# EAGLE design din-synch-hub (EAGLE 6.6.0)
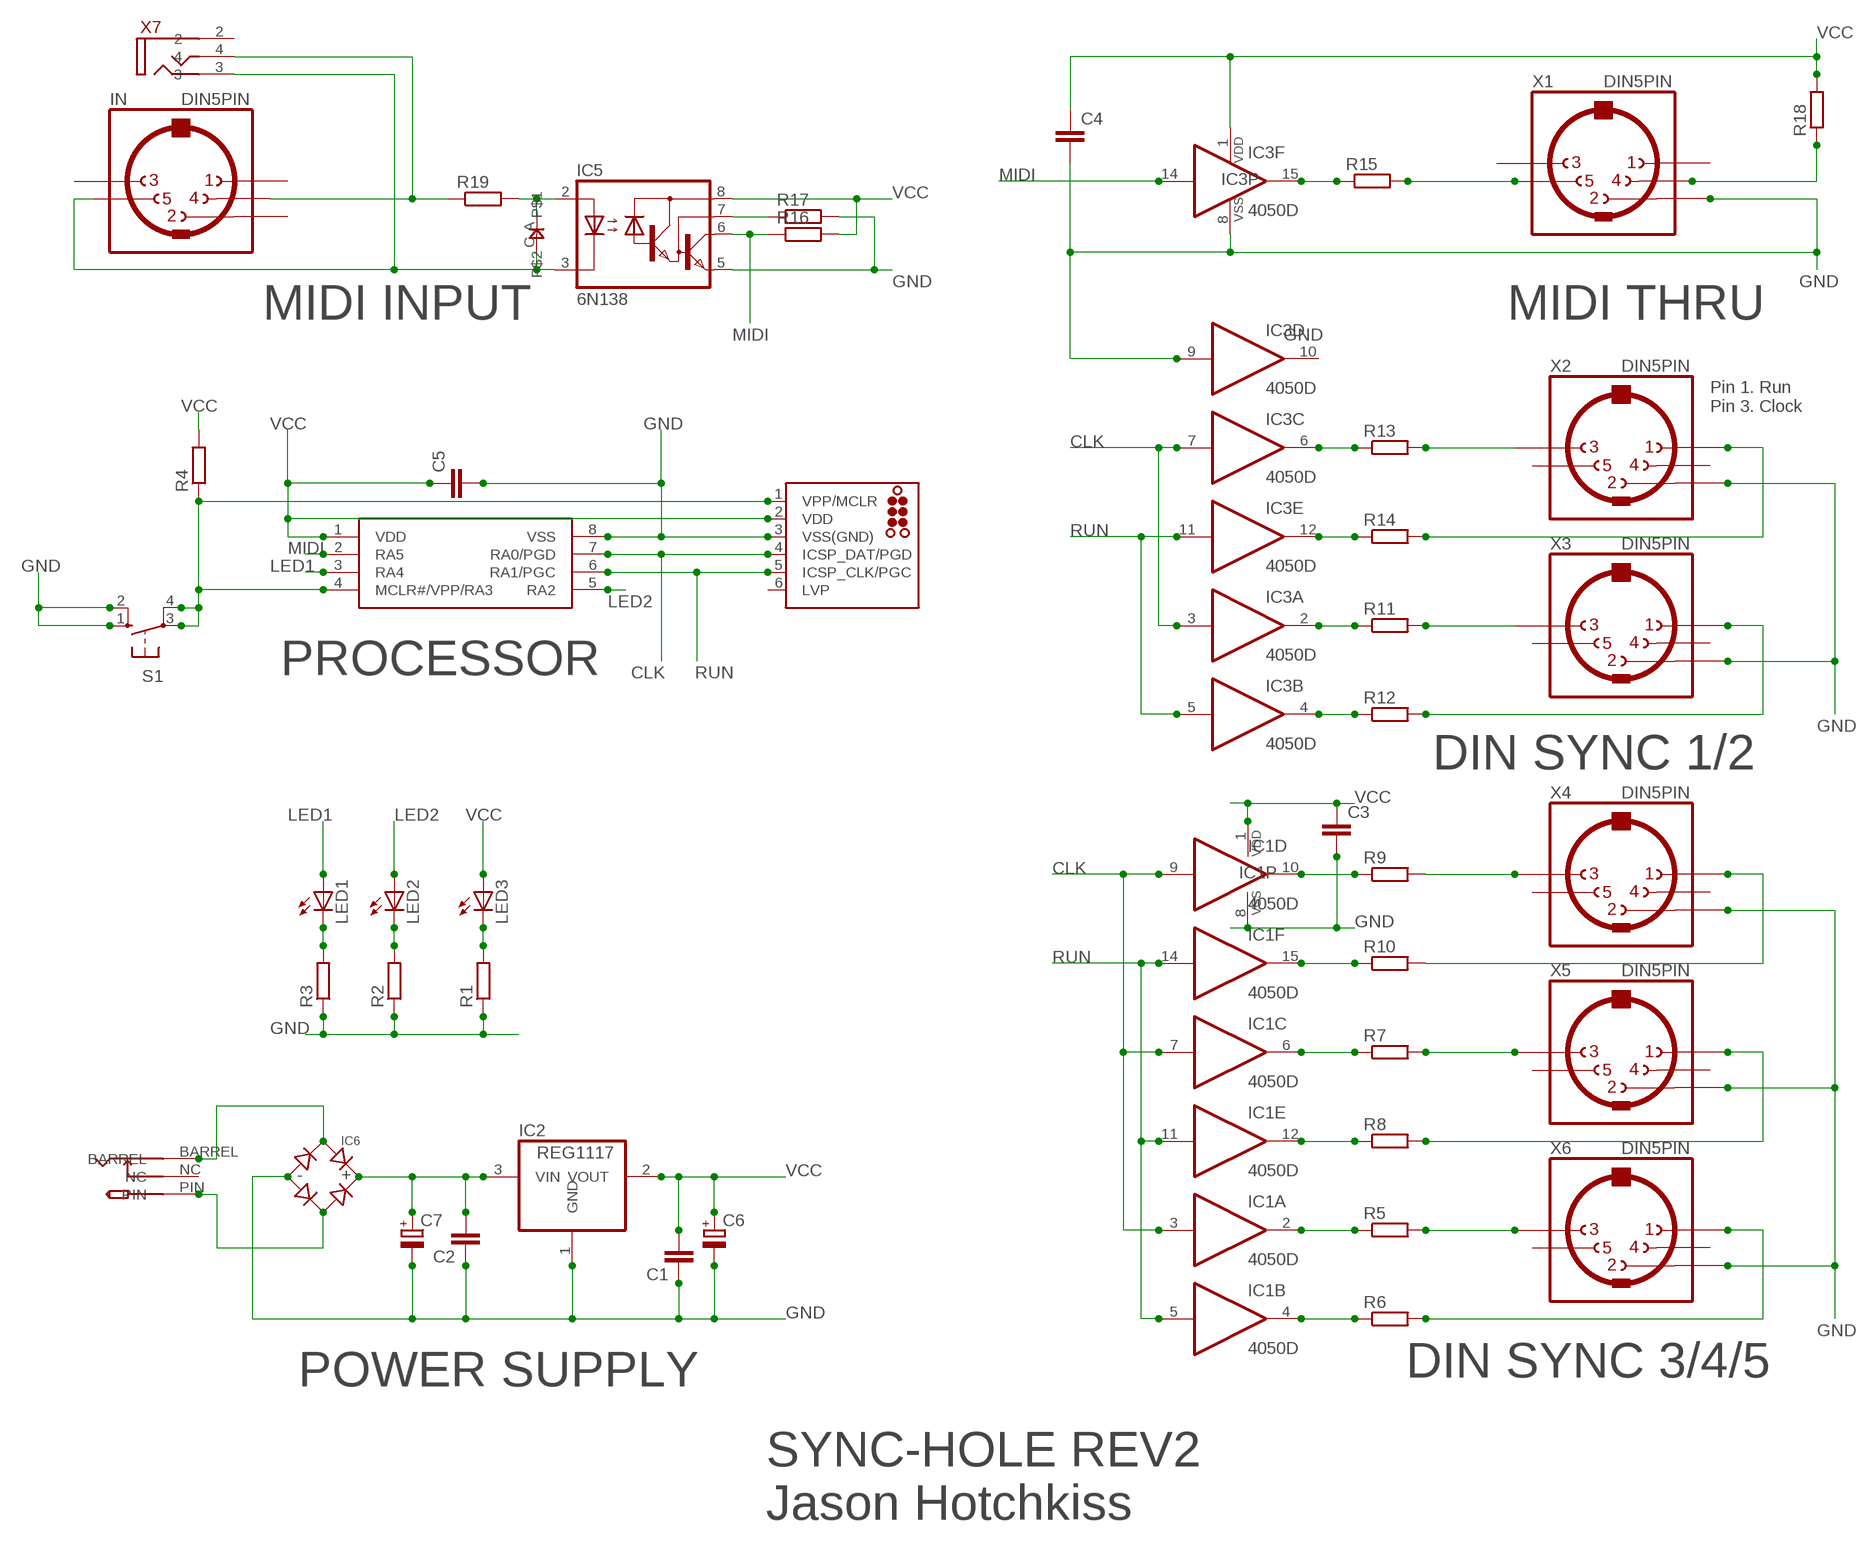
[diagram p0: schematic, sheet 1]

## Parts
C1  C-EUC0805  [C0805]
C2  C-EUC0805  [C0805]
C3  C-EUC0805  [C0805]
C4  C-EUC0805  [C0805]
C5  C-EUC0805  [C0805]
C6  CPOL-EUE2,5-6E  [E2,5-6E]
C7  CPOL-EUE2,5-6E  [E2,5-6E]
D1  0805DIODE  [0805DIODE]
IC1  4050D  [SO16]
IC2  REG1117  [SOT223]
IC3  4050D  [SO16]
IC4  PIC12F1822SO08  [SO08]
IC5  6N138  [DIL08]
IC6  BRIDGERECTIFIER  [SOIC-4]
ICSP  TC2030-MCP-NL  [TC2030-MCP-NL]
IN  DIN5PIN  [EDGEDIN]
LED1  LED3MM  [LED3MM]
LED2  LED3MM  [LED3MM]
LED3  LED3MM  [LED3MM]
R1  R-EU_R0805  [R0805]
R2  R-EU_R0805  [R0805]
R3  R-EU_R0805  [R0805]
R4  R-EU_R0805  [R0805]
R5  R-EU_R0805  [R0805]
R6  R-EU_R0805  [R0805]
R7  R-EU_R0805  [R0805]
R8  R-EU_R0805  [R0805]
R9  R-EU_R0805  [R0805]
R10  R-EU_R0805  [R0805]
R11  R-EU_R0805  [R0805]
R12  R-EU_R0805  [R0805]
R13  R-EU_R0805  [R0805]
R14  R-EU_R0805  [R0805]
R15  R-EU_R0805  [R0805]
R16  R-EU_R0805  [R0805]
R17  R-EU_R0805  [R0805]
R18  R-EU_R0805  [R0805]
R19  R-EU_R0805  [R0805]
S1  10-XX  [B3F-10XX]
U$1  PWR_SOCKET_2_1MM  [PWR_SOCKET_2_1MM]
X1  DIN5PIN  [EDGEDIN]
X2  DIN5PIN  [EDGEDIN]
X3  DIN5PIN  [EDGEDIN]
X4  DIN5PIN  [EDGEDIN]
X5  DIN5PIN  [EDGEDIN]
X6  DIN5PIN  [EDGEDIN]
X7  VERTICAL_3_5MM_SOCKET  [VERTICAL_3_5MM_SOCKET]

## Nets
CLK: IC1.3(A:I) IC1.7(C:I) IC1.9(D:I) IC3.3(A:I) IC3.7(C:I) IC4.7(RA0/PGD) ICSP.4(ICSP_DAT/PGD)
GND: C1.1 C2.1 C3.2 C4.2 C5.2 C6.- C7.- IC1.8(P:VSS) IC2.1(GND) IC3.8(P:VSS) IC3.9(D:I) IC4.8(VSS) IC5.5(GND) IC6.- ICSP.3(VSS(GND)) R1.1 R2.1 R3.1 R17.2 S1.1(S) S1.2(S1) X1.2 X2.2 X3.2 X4.2 X5.2 X6.2
LED1: IC4.3(RA4) LED1.A
LED2: IC4.5(RA2) LED2.A
MIDI: IC3.14(F:I) IC4.2(RA5) IC5.6(VO) R16.1
N$1: IC3.15(F:O) R15.1
N$2: R15.2 X1.5
N$3: IC3.6(C:O) R13.1
N$4: R18.1 X1.4
N$5: IC3.12(E:O) R14.1
N$6: R13.2 X2.3
N$7: IC3.4(B:O) R12.1
N$8: R14.2 X2.1
N$9: IC3.2(A:O) R11.1
N$10: R11.2 X3.3
N$11: R12.2 X3.1
N$12: IC1.15(F:O) R10.1
N$13: IC1.12(E:O) R8.1
N$14: R9.2 X4.3
N$15: IC1.10(D:O) R9.1
N$16: R10.2 X4.1
N$17: IC1.2(A:O) R5.1
N$18: R7.2 X5.3
N$19: IC1.4(B:O) R6.1
N$20: R8.2 X5.1
N$21: IC1.6(C:O) R7.1
N$22: R5.2 X6.3
N$23: R6.2 X6.1
N$25: D1.C IC5.3(C) IN.5 X7.3
N$26: IN.4 R19.1 X7.4
N$27: D1.A IC5.2(A) R19.2
N$28: LED3.K(C) R1.2
N$29: IC5.7(VB) R17.1
N$30: IC4.4(MCLR#/VPP/RA3) ICSP.1(VPP/MCLR) R4.1 S1.3(P) S1.4(P1)
N$31: LED2.K(C) R2.2
N$32: C2.2 C7.+ IC2.3(VIN) IC6.+
N$33: LED1.K(C) R3.2
N$36: IC6.~2(AC2) U$1.PIN
N$37: IC6.~1(AC1) U$1.BARREL
RUN: IC1.5(B:I) IC1.11(E:I) IC1.14(F:I) IC3.5(B:I) IC3.11(E:I) IC4.6(RA1/PGC) ICSP.5(ICSP_CLK/PGC)
VCC: C1.2 C3.1 C4.1 C5.1 C6.+ IC1.1(P:VDD) IC2.2(VOUT) IC3.1(P:VDD) IC4.1(VDD) IC5.8(VCC) ICSP.2(VDD) LED3.A R4.2 R16.2 R18.2
Unconnected: IC3.10(D:O) ICSP.6(LVP) IN.1 IN.2 IN.3 U$1.NC X1.1 X1.3 X2.4 X2.5 X3.4 X3.5 X4.4 X4.5 X5.4 X5.5 X6.4 X6.5 X7.2

## Notes on the sheet
- MIDI INPUT | MIDI THRU
- Pin 1. Run
  Pin 3. Clock
- PROCESSOR
- DIN SYNC 1/2
- POWER SUPPLY | DIN SYNC 3/4/5
- SYNC-HOLE REV2
- Jason Hotchkiss

## Library data of the parts
C1-C5 = rcl:C-EU: CAPACITOR, European symbol
C6 C7 = rcl:CPOL-EU: POLARIZED CAPACITOR, European symbol
D1 = jasons_stuff:0805DIODE
IC1 IC3 = 40xx:4050: Hex non-inverting BUFFER
IC2 = burr-brown:REG1117: 800mA and 1A Low Dropout (LDO) Positive Regulator 1.8V, 2.5V, 2.85V, 3.3V, 5V, and Adj; MPN: REG1117; OC_FARNELL: 1097566; OC_NEWARK: 14P6981
IC4 = jasons_stuff:PIC12F1822
IC5 = optocoupler:6N138: MOTOROLA OPTO COUPLER; MF: VISHAY/TELEFUNKEN; MPN: 6N138; OC_FARNELL: 9860150; OC_NEWARK: 35K5294
IC6 = microbuilder:BRIDGERECTIFIER: Bridge Rectifier SOIC-4: Comchip B4S-G - 400V 800mA, Peak Vf 1.1V (Digikey: 641-1334-1-ND)
ICSP = tag-connect:TC2030: TAG-CONNECT ICSP Connector Manufacturer: Tag-Connect <http://www.tag-connect.com> Cable for easy In-Circuit Serial Programming. Designed for Microchip ICD2, suitable for many others. Two variants - one "with legs" (for hands-free fit on PCB) and another "without legs" for quick programming. PAD Description 1 MCLR/Vpp 2 Vdd 3 GND 4 PGD (ISPDAT) 5 PGC (ISPCLK) 6 nc (used for LVP) ©2009 ROFA.cz - modified and updated by Robert Darlington ‹rdarlington@gmail.com›
IN X1-X6 = jason_eagle6:DIN5PIN: Female CONNECTOR 5 pins 90 deg. with shield, horizontal (DIN 41524)
LED1-LED3 = led:LED: LED OSRAM: - CHIPLED LG R971, LG N971, LY N971, LG Q971, LY Q971, LO R971, LY R971 LH N974, LH R974 LS Q976, LO Q976, LY Q976 LO Q996 - Hyper CHIPLED LW Q18S LB Q993, LB Q99A, LB R99A - SideLED LS A670, LO A670, LY A670, LG A670, LP A670 LB A673, LV A673, LT A673, LW A673 LH A674 LY A675 LS A676, LA A676, LO A676, LY A676, LW A676 LS A679, LY A679, LG A679 - Hyper Micro SIDELED® LS Y876, LA Y876, LO Y876, LY Y876 LT Y87S - SmartLED LW L88C, LW L88S LB L89C, LB L89S, LG L890 LS L89K, LO L89K, LY L89K LS L896, LA L896, LO L896, LY L896 - TOPLED LS T670, LO T670, LY T670, LG T670, LP T670 LSG T670, LSP T670, LSY T670, LOP T670, LYG T670 LG T671, LOG T671, LSG T671 LB T673, LV T673, LT T673, LW T673 LH T674 LS T676, LA T676, LO T676, LY T676, LB T676, LH T676, LSB T676, LW T676 LB T67C, LV T67C, LT T67C, LS T67K, LO T67K, LY T67K, LW E67C LS E67B, LA E67B, LO E67B, LY E67B, LB E67C, LV E67C, LT E67C LW T67C LS T679, LY T679, LG T679 LS T770, LO T770, LY T770, LG T770, LP T770 LB T773, LV T773, LT T773, LW T773 LH T774 LS E675, LA E675, LY E675, LS T675 LS T776, LA T776, LO T776, LY T776, LB T776 LHGB T686 LT T68C, LB T68C - Hyper Mini TOPLED® LB M676 - Mini TOPLED Santana® LG M470 LS M47K, LO M47K, LY M47K Source: http://www.osram.convergy.de LUXEON: - LUMILED® LXK2-PW12-R00, LXK2-PW12-S00, LXK2-PW14-U00, LXK2-PW14-V00 LXK2-PM12-R00, LXK2-PM12-S00, LXK2-PM14-U00 LXK2-PE12-Q00, LXK2-PE12-R00, LXK2-PE12-S00, LXK2-PE14-T00, LXK2-PE14-U00 LXK2-PB12-K00, LXK2-PB12-L00, LXK2-PB12-M00, LXK2-PB14-N00, LXK2-PB14-P00, LXK2-PB14-Q00 LXK2-PR12-L00, LXK2-PR12-M00, LXK2-PR14-Q00, LXK2-PR14-R00 LXK2-PD12-Q00, LXK2-PD12-R00, LXK2-PD12-S00 LXK2-PH12-R00, LXK2-PH12-S00 LXK2-PL12-P00, LXK2-PL12-Q00, LXK2-PL12-R00 Source: www.luxeon.com KINGBRIGHT: KA-3528ASYC Source: www.kingbright.com
R1-R19 = rcl:R-EU_: RESISTOR, European symbol
S1 = switch-omron:10-XX: OMRON SWITCH; MPN: B3F-1000; OC_FARNELL: 176432; OC_NEWARK: 36M3542
U$1 = jason_eagle6:PWR_SOCKET_2_1MM
X7 = jason_eagle6:VERTICAL_3_5MM_SOCKET

## Board
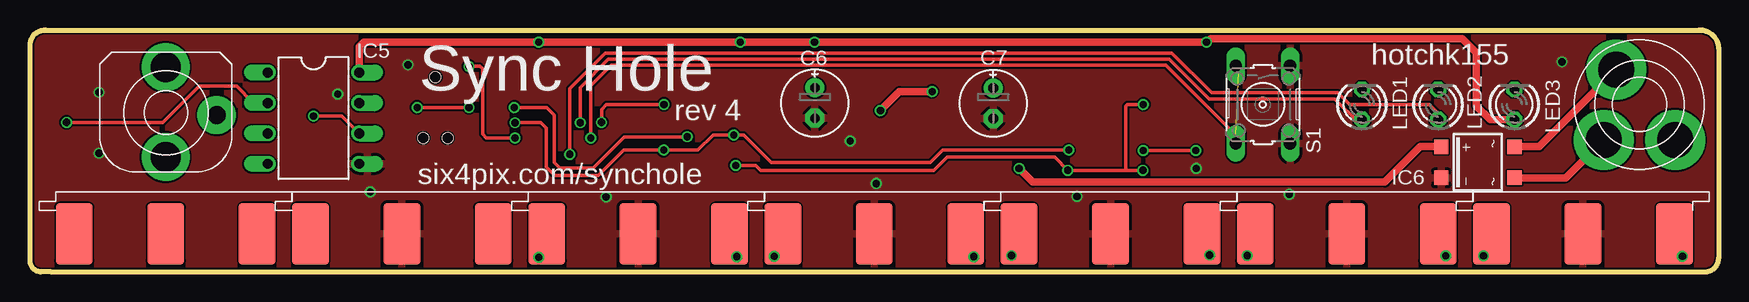
[diagram p1: board, top side]
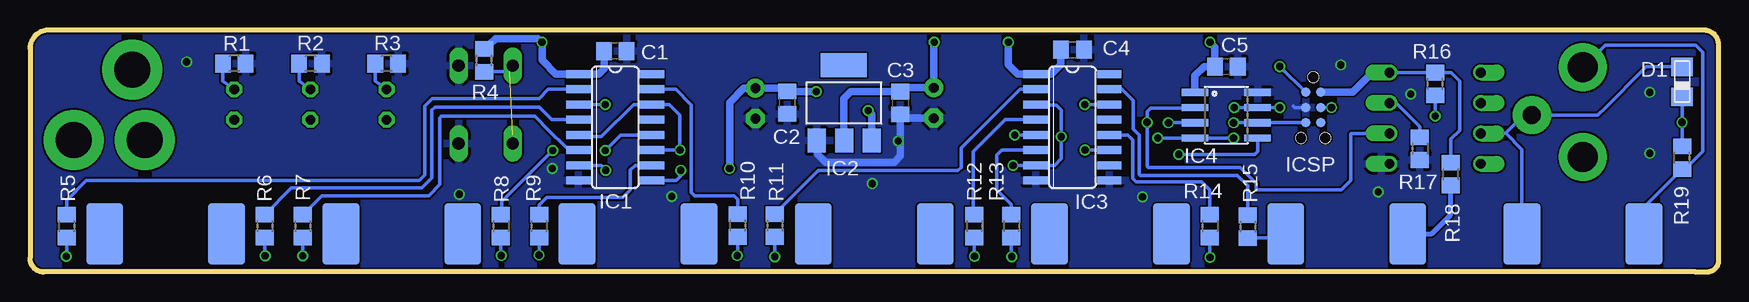
[diagram p2: board, bottom side, seen from below]

Size 140.72 x 20.19 mm. Coordinates in mm from the lower left corner, seen from the top.
Outline: 1.91,0 139.57,0 arc90 140.72,1.14 140.72,18.67 arc90 139.07,20.19 1.27,20.19 arc90 0,18.92 0,1.02 arc90 0.89,0 1.78,0
Copper layers (1*16): Top 0.035mm / dielectric 1.5mm / Bottom 0.035mm
Design rules "hackvana": minimum track width 6mil, minimum drill 0.3mm, track to track 6mil, track to pad 9mil, pad to pad 6mil, via to via 6mil, smd to smd 0mil, copper to edge 6mil, drill to drill 6mil, minimum pad ring 10mil, minimum via ring 6mil, stop-mask expansion 2mil, vias tented up to drill 100mil, thermal gap 10mil

### Footprints (pad centres in the part's own frame; a part is rotated, then mirrored left to right if it is on the bottom)
C0805 = smd 1.3 x 1.5: 1 -0.95,0; 2 0.95,0
E2,5-6E = drill 0.813 pad 1.575: + -1.27,0 | drill 0.813 pad 1.575 octagon: - 1.27,0
0805DIODE = smd 1.524 x 1.778: A -1.262,-0.005; C 1.238,-0.005
SO16 = smd 0.66 x 2.032: 1 -4.445,-3.073; 2 -3.175,-3.073; 3 -1.905,-3.073; 4 -0.635,-3.073; 5 0.635,-3.073; 6 1.905,-3.073; 7 3.175,-3.073; 8 4.445,-3.073; 9 4.445,3.073; 10 3.175,3.073; 11 1.905,3.073; 12 0.635,3.073; 13 -0.635,3.073; 14 -1.905,3.073; 15 -3.175,3.073; 16 -4.445,3.073
SOT223 = smd 1.499 x 2.007: 1 -2.261,-3.15; 2 0.025,-3.15; 3 2.311,-3.15 | smd 3.81 x 2.007: 4 0,3.15
SO08 = smd 0.61 x 2.21: 1 -1.905,-2.616; 2 -0.635,-2.616; 3 0.635,-2.616; 4 1.905,-2.616; 5 1.905,2.616; 6 0.635,2.616; 7 -0.635,2.616; 8 -1.905,2.616
DIL08 = drill 0.813 offset: 1 -3.81,-3.81; 2 -1.27,-3.81; 3 1.27,-3.81; 4 3.81,-3.81; 5 3.81,3.81; 6 1.27,3.81; 7 -1.27,3.81; 8 -3.81,3.81
SOIC-4 = smd 1.2 x 1.2: + 1.3,3.05; - -1.3,3.05; ~1 -1.3,-3.05; ~2 1.3,-3.05
TC2030-MCP-NL = smd 0.787 x 0.787: 1 1.27,-0.635; 2 1.27,0.635; 3 2.54,-0.635; 4 2.54,0.635; 5 3.81,-0.635; 6 3.81,0.635 | hole 0.889: 0,0; 5.08,-1.016; 5.08,1.016
EDGEDIN = smd 3.048 x 5.08: 1 -7.62,-10.16; 2 0,-10.16; 3 7.62,-10.16 | smd 3.048 x 5.08 bottom: 4 -5.08,-10.16; 5 5.08,-10.16
LED3MM = drill 0.813 octagon: A -1.27,0; K 1.27,0
R0805 = smd 1.3 x 1.5: 1 -0.95,0; 2 0.95,0
B3F-10XX = drill 1.016 long: 1 -3.251,2.261; 2 3.251,2.261; 3 -3.251,-2.261; 4 3.251,-2.261
PWR_SOCKET_2_1MM = drill 3 pad 5: BARREL 0,4.2; NC -4.2,0; PIN 3.4,-0.7
VERTICAL_3_5MM_SOCKET = drill 2.5 pad 4: 2 0,-3.75; 4 0,3.75 | drill 1.5 pad 3.2: 3 4.25,-0.25

### Placement (x,y rotation side)
C1  91.95,18.42 180 bottom
C2  77.6,14.13 90 bottom
C3  68.2,14.1 270 bottom
C4  53.85,18.54 0 bottom
C5  41.02,17.14 0 bottom
C6  65.41,14.1 270 top
C7  80.27,14.07 270 top
D1  3.05,15.87 90 bottom
IC1  91.95,12.06 270 bottom
IC2  72.9,14.1 0 bottom
IC3  53.85,12.06 270 bottom
IC4  41.02,13.08 270 bottom
IC5  23.62,12.83 270 top
IC6  120.65,9.14 90 top
ICSP  33.78,16.26 270 bottom
IN  11.3,13.33 0 top
LED1  111,13.97 90 top
LED2  117.35,13.97 90 top
LED3  123.7,13.97 90 top
R1  123.7,17.4 180 bottom
R2  117.35,17.4 180 bottom
R3  111,17.4 180 bottom
R4  102.87,17.65 90 bottom
R5  137.67,3.81 270 bottom
R6  121.16,3.81 270 bottom
R7  117.98,3.81 270 bottom
R8  101.47,3.81 270 bottom
R9  98.3,3.81 270 bottom
R10  81.76,3.87 270 bottom
R11  78.65,3.87 270 bottom
R12  62.01,3.81 270 bottom
R13  58.93,3.81 270 bottom
R14  42.39,3.81 270 bottom
R15  39.24,3.78 270 bottom
R16  23.62,15.68 90 bottom
R17  24.89,10.29 270 bottom
R18  22.32,8.16 90 bottom
R19  3.05,9.52 90 bottom
S1  102.74,13.97 270 top
U$1  134.11,13.97 135 top
X1  30.99,13.33 0 top
X2  50.67,13.33 0 top
X3  70.36,13.33 0 top
X4  90.04,13.33 0 top
X5  109.73,13.33 0 top
X6  129.41,13.33 0 top
X7  11.3,13.33 0 top

### Tracks (layer width: path | path; a pad name or v marks a point on that pad's centre or on a via)
CLK  (via drill 0.6)
  Top 0.305: v36.58,13.72 v32.26,13.72 | v58.8,8.89 60.49,8.89 60.9,8.48 75.31,8.48 76.42,9.59 85.38,9.59 v86.49,8.48 91.31,8.48 | v40.36,13.72 43.05,13.72 43.69,13.08 43.69,9.11 44.13,8.67 46.93,8.67 49.53,11.27 v54.77,11.27 | v92.77,13.97 91.44,13.97 91.31,13.84 91.31,8.48 | v92.74,8.48 91.31,8.48
  Bottom 0.305: v36.58,13.72 IC4.7 v40.36,13.72 | v32.26,13.72 ICSP.4 | v92.77,13.97 IC1.3 | IC1.9 86.87,7.62 86.52,7.97 v86.49,8.48 | IC1.7 93.09,8.89 v92.74,8.48 | v58.8,8.89 IC3.7 55.34,8.89 54.77,9.46 v54.77,11.27 54.77,13.52 55.18,13.94 56.89,13.94 IC3.3
GND  (via drill 0.6)
  Bottom 0.305: ICSP.3 35.31,13.72 35.43,13.84
  Bottom 0.61: C6.- 67.88,12.83 C3.2 68.2,9.65 68.71,9.14 74.42,9.14 75.06,9.78 75.06,10.85 IC2.1
  other vias: 97.19,8.64 87.25,6.29 70.52,7.37 68.36,10.92 48.01,6.25 5.75,14.99 5.75,9.91 28.35,6.67 31.5,17.27 25.66,14.83 127.67,17.53 104.94,6.48
  pour Bottom: -0.13,22.73 142.11,22.73 142.11,-3.94 -2.67,-3.94 -2.67,22.73
  pour Top: -1.4,22.73 -1.4,-1.4 142.11,-1.4 142.11,22.73
LED1  (via drill 0.6)
  Top 0.305: LED1.A 110.71,12.45 108.75,14.41 98.27,14.41 94.93,17.75 48.2,17.75 45.85,15.4 v45.85,12.45
  Bottom 0.305: IC4.3 v45.85,12.45
LED2  (via drill 0.6)
  Top 0.305: LED2.A 117.35,13.21 116.59,13.97 109.98,13.97 109,14.95 98.46,14.95 95.16,18.26 47.94,18.26 44.99,15.3 v44.99,9.81
  Bottom 0.305: IC4.5 38.41,10.05 38.64,9.81 v44.99,9.81
MIDI  (via drill 0.6)
  Top 0.305: v52.83,13.97 48.04,13.97 47.63,13.56 v47.63,12.48 | v23.62,13.02 25.97,13.02 IC5.6
  Bottom 0.305: IC4.2 43.67,13.68 47.34,13.68 47.63,13.4 v47.63,12.48 47.63,8.79 47.53,8.7 39.85,8.7 38.55,7.4 38.55,6.89 38.48,6.83 31.47,6.83 30.67,7.62 30.67,11.49 30.61,11.56 IC5.6 | IC3.14 v52.83,13.97 | R16.1 v23.62,13.02
N$1
  Bottom 0.305: R15.1 39.24,7.21 40.1,8.06 48.2,8.06 48.26,8.13 48.26,11.43 48.77,11.94 48.77,14.29 49.72,15.24 IC3.15
N$2
  Bottom 0.305: R15.2 36.42,2.83 X1.5
N$3
  Bottom 0.305: IC3.6 59.72,10.16 60.14,9.75 60.14,6.86 58.93,5.65 R13.1
N$4
  Bottom 0.406: X1.4 23.91,3.17 22.32,4.76 R18.1
N$5
  Bottom 0.305: R14.1 42.42,6.86 43.05,7.49 48.52,7.49 48.8,7.78 48.8,10.99 49.25,11.43 IC3.12
N$6  (via drill 0.6)
  Top 0.305: v58.9,1.27 58.9,2.57 X2.3
  Bottom 0.305: R13.2 58.93,1.3 v58.9,1.27
N$7
  Bottom 0.305: IC3.4 59.44,12.7 62.1,10.03 62.1,4.86 R12.1
N$8  (via drill 0.6)
  Top 0.305: v42.39,1.21 42.39,2.51 X2.1
  Bottom 0.305: R14.2 v42.39,1.21
N$9
  Bottom 0.305: IC3.2 58.2,15.24 63.12,10.32 63.12,8.73 63.41,8.44 75.02,8.44 R11.1
N$10  (via drill 0.6)
  Top 0.305: v78.65,1.27 78.65,2.51 X3.3
  Bottom 0.305: R11.2 v78.65,1.27
N$11  (via drill 0.6)
  Top 0.305: v62.01,1.3 62.01,2.45 X3.1
  Bottom 0.305: R12.2 v62.01,1.3
N$12
  Bottom 0.305: IC1.15 86.9,15.24 85.6,13.94 85.6,6.64 85.31,6.35 82.04,6.35 81.76,6.06 R10.1
N$13  (via drill 0.6)
  Top 0.305: v92.77,10.13 v97.16,10.13
  Bottom 0.305: R8.1 101.41,4.83 101.41,5.88 v97.16,10.13 | IC1.12 91.47,11.43 v92.77,10.13
N$14  (via drill 0.6)
  Top 0.305: v98.3,1.4 98.3,2.54 X4.3
  Bottom 0.305: R9.2 v98.3,1.4
N$15
  Bottom 0.305: R9.1 98.3,5.59 97.66,6.22 91.31,6.22 90.68,6.86 90.68,8.51 90.3,8.89 IC1.10
N$16  (via drill 0.6)
  Top 0.305: X4.1 82.42,2 v81.79,1.36 81.79,2.54 X4.1
  Bottom 0.305: R10.2 81.76,1.4 v81.79,1.36
N$17
  Bottom 0.305: IC1.2 97.54,15.24 98.3,14.48 107.19,14.48 107.82,13.84 107.82,8.1 108.3,7.62 108.94,7.62 109.54,7.62 136.02,7.62 137.67,5.97 R5.1
N$18  (via drill 0.6)
  Top 0.305: v117.98,1.33 117.98,2.54 X5.3
  Bottom 0.305: R7.2 v117.98,1.33
N$19
  Bottom 0.305: R6.1 118.93,6.99 108.08,6.99 107.22,7.84 107.22,13.49 106.97,13.75 98.3,13.75 97.25,12.7 IC1.4
N$20  (via drill 0.6)
  Top 0.305: v101.44,1.36 101.44,2.51 X5.1
  Bottom 0.305: R8.2 101.47,1.36 v101.44,1.36
N$21
  Bottom 0.305: R7.1 116.39,6.35 107.51,6.35 106.55,7.3 106.55,12.86 106.43,12.99 98.65,12.99 98.28,12.62 97.76,12.1 95.82,10.16 IC1.6
N$22  (via drill 0.6)
  Top 0.305: v137.7,1.3 137.7,2.51 X6.3
  Bottom 0.305: R5.2 137.67,1.33 v137.7,1.3
N$23  (via drill 0.6)
  Top 0.305: v121.13,1.33 121.13,2.51 X6.1
  Bottom 0.305: R6.2 121.16,1.36 v121.13,1.33
N$25
  Bottom 0.305: IN.5 16.38,10.22 17.75,11.59 | 17.75,11.59 19.78,11.59 IC5.3 | 17.75,11.59 16.25,13.08 X7.3 10.06,13.08 9.81,13.33 9.67,13.48 6.03,17.11 D1.C
N$26
  Bottom 0.305: IN.4 6.22,5.4 R19.1 2.79,8.57 1.3,10.06 1.3,18.32 1.91,18.92 9.47,18.92 X7.4
N$27  (via drill 0.6)
  Top 0.305: IC5.2 19.78,14.13 18.58,14.13 17.21,15.49 14.1,15.49 11.08,12.48 v3.05,12.48
  Bottom 0.305: R19.2 v3.05,12.48 | v3.05,12.48 D1.A v3.04,12.48 v3.05,12.48
N$28
  Bottom 0.305: R1.2 124.65,15.94 LED3.K
N$29
  Bottom 0.305: R17.1 24.89,12.13 26.89,14.13 27.4,14.13 IC5.7
N$30  (via drill 0.6)  (1 unrouted)
  Top 0.305: S1.4 100.48,11.4 94.65,17.24 48.42,17.24 46.74,15.56 v46.74,11.18 | v40.42,11.18 38.01,11.18 37.72,11.49 37.72,16.95 37.5,17.18 36.61,17.18 v36.58,17.14
  Bottom 0.305: R4.1 100.75,16.7 S1.3 | v40.42,11.18 IC4.4 v46.74,11.18 | ICSP.1 v36.58,17.14
N$31
  Bottom 0.305: R2.2 118.3,15.94 LED2.K
N$32  (via drill 0.6)
  Top 0.61: IC6.+ 115.86,10.44 112.9,7.49 83.57,7.49 v82.42,8.64 | v70.87,13.46 72.46,15.05 v75.19,15.05
  Bottom 0.61: IC2.3 70.59,13.18 v70.87,13.46 | v75.19,15.05 77.57,15.05 C2.2 77.86,15.33 C7.+ 81.22,15.33 82.42,14.13 v82.42,8.64
N$33
  Bottom 0.305: R3.2 111.95,15.94 LED1.K
N$36
  Top 0.61: IC6.~2 125.78,10.44 U$1.PIN
N$37
  Top 0.61: IC6.~1 127.99,7.84 U$1.BARREL
RUN  (via drill 0.6)
  Top 0.305: v40.42,12.45 42.58,12.45 43.02,12 43.02,8.76 43.72,8.06 47.37,8.06 49.47,10.16 v52.8,10.16 55.65,10.16 IC3.5 v58.64,11.43 59.47,11.43 61.79,9.11 75,9.11 75.03,9.14 75.36,9.48 76.04,10.16 v86.55,10.16
  Bottom 0.305: 94.9,11.3 IC1.5 95.12,11.33 95.12,11.3 93.09,11.3 90.43,13.97 IC1.14 87.44,13.97 86.55,13.08 v86.55,10.16 IC1.11 | ICSP.5 IC4.6 v40.42,12.45 | v58.64,11.43 IC3.5 | IC3.11 v52.8,10.16
VCC  (via drill 0.6)
  Top 0.61: IC5.8 27.43,18.8 27.81,19.18 v42.39,19.18 v59.18,19.18 | v59.18,19.18 58.55,19.18 | v59.18,19.18 v65.37,19.18 v98.05,19.18 98.39,19.46 119.35,19.46 120.52,18.29 120.52,13.84 121.67,12.7 LED3.A
  Bottom 0.305: 23.59,16.54 R16.2 | R16.2 IC5.8 | R18.2 22.32,11.08 21.59,11.81 21.59,15.94 22.29,16.64 R16.2
  Bottom 0.61: IC2.2 72.9,10.97 72.9,14.48 72.33,15.05 C3.1 68.39,15.05 68.45,15.11 68.2,15.37 C6.+ 65.41,19.14 v65.37,19.18 | R4.2 101.92,19.46 98.39,19.46 v98.05,19.18 98.05,17.65 96.9,16.51 IC1.1 93.31,16.51 92.87,16.95 92.87,18.39 C1.2 | IC4.1 43.64,16.37 42.86,17.14 C5.1 41.97,18.76 v42.39,19.18 | C4.1 54.8,17.3 55.6,16.51 IC3.1 58.39,16.51 59.18,17.3 v59.18,19.18 | IC5.8 28.86,16.64 30.48,15.02 33.12,15.02 ICSP.2

### Text on the board
tPlace: hotchk155 | Sync Hole | rev 4 | six4pix.com/synchole